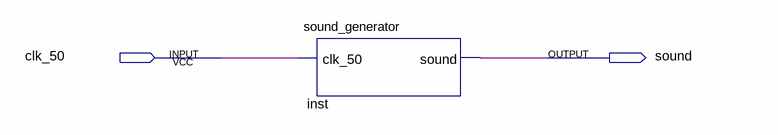
[diagram p0: schematic sheet]
// Quartus schematic SoundGenerator.bdf as structural Verilog: 1 symbols, 2 pins
module SoundGenerator (
  input  clk_50,
  output sound
);

  sound_generator inst (.clk_50(clk_50), .sound(sound));
endmodule
